# EAGLE design Lm317 (EAGLE 9.6.2)
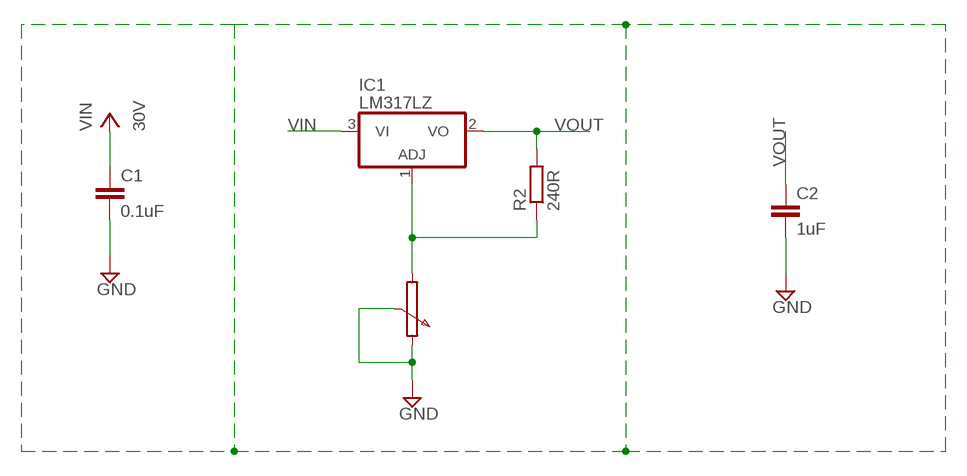
[diagram p0: schematic, sheet 1]

## Parts
C1  0.1uF  C-EU050-025X075  [C050-025X075]
C2  1uF  C-EU050-025X075  [C050-025X075]
IC1  LM317LZ  [TO92]
R2  240R  R-EU_0207/10  [0207/10]

## Nets
GND: C1.2 C2.2
N$4: IC1.1(ADJ) R2.1
VIN: C1.1 IC1.3(VI) ; supply symbol labelled 30V
VOUT: C2.1 IC1.2(VO) R2.2

## Library data of the parts
C1 C2 = rcl:C-EU: CAPACITOR, European symbol; SPICEPREFIX: C
IC1 = linear:*317: Positive VOLTAGE REGULATOR
R2 = rcl:R-EU_: RESISTOR, European symbol; SPICEPREFIX: R

## Board
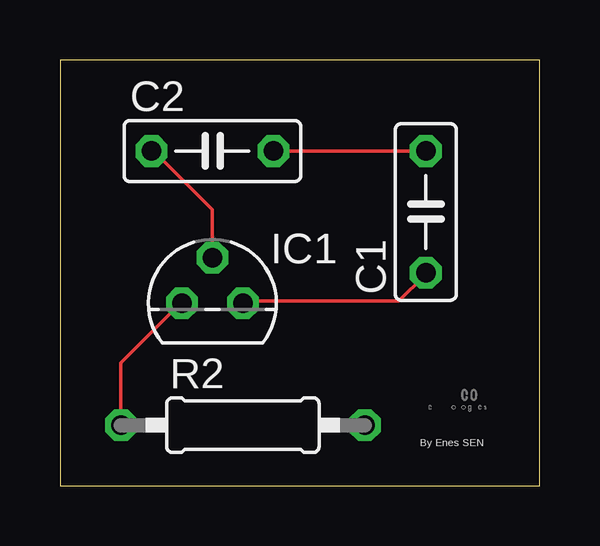
[diagram p1: board, top side]
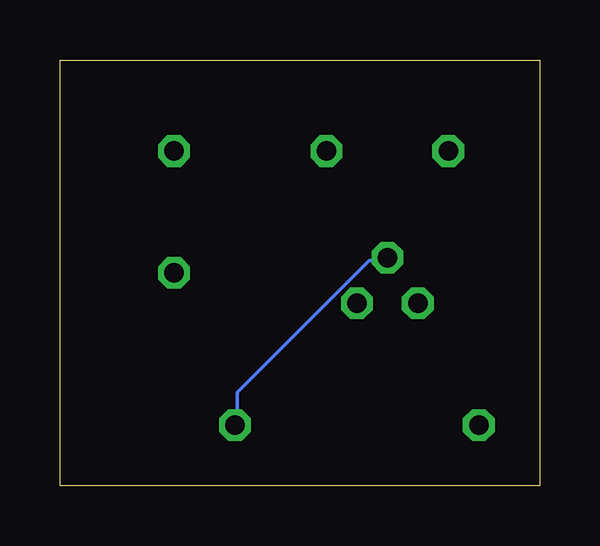
[diagram p2: board, bottom side, seen from below]

Size 19.99 x 17.77 mm. Coordinates in mm from the lower left corner, seen from the top.
Outline: 0,0 19.99,0 19.99,17.77 0,17.77 0,0
Copper layers (1*16): Top 0.035mm / dielectric 1.5mm / Bottom 0.035mm
Design rules "default": minimum track width 6mil, minimum drill 0.35mm, track to track 6mil, track to pad 6mil, pad to pad 6mil, via to via 6mil, smd to smd 6mil, copper to edge 40mil, drill to drill 6mil, minimum pad ring 10mil, minimum via ring 8mil, stop-mask expansion 4mil, vias tented up to drill 0mil, thermal gap 10mil

### Footprints (pad centres in the part's own frame; a part is rotated, then mirrored left to right if it is on the bottom)
C050-025X075 = drill 0.813 octagon: 1 -2.54,0; 2 2.54,0
TO92 = drill 0.813 octagon: 1 -1.27,0; 2 0,1.905; 3 1.27,0
0207/10 = drill 0.813 octagon: 1 -5.08,0; 2 5.08,0

### Placement (x,y rotation side)
C1  15.24,11.43 90 top
C2  6.35,13.97 0 top
IC1  6.35,7.62 0 top
R2  7.62,2.54 0 top
U$1  [LOGO]  13.97,2.54 0 top

### Tracks (layer width: path | path; a pad name or v marks a point on that pad's centre or on a via)
GND
  Top 0.152: C1.2 C2.2
N$4
  Top 0.152: R2.1 2.54,5.13 4.98,7.57 IC1.1
VIN
  Top 0.152: IC1.3 7.72,7.72 14.12,7.72 15.19,8.79 C1.1
VOUT
  Top 0.152: IC1.2 6.35,11.53 3.91,13.97 C2.1
  Bottom 0.152: R2.2 12.6,2.54 12.6,3.91 7.11,9.4 6.35,9.4 IC1.2

### Text on the board
tNames: By Enes SEN